# Altium schematic sheet main.SchDoc
size Tabloid; SheetNumber: 1; SheetTotal: 1; Page: main
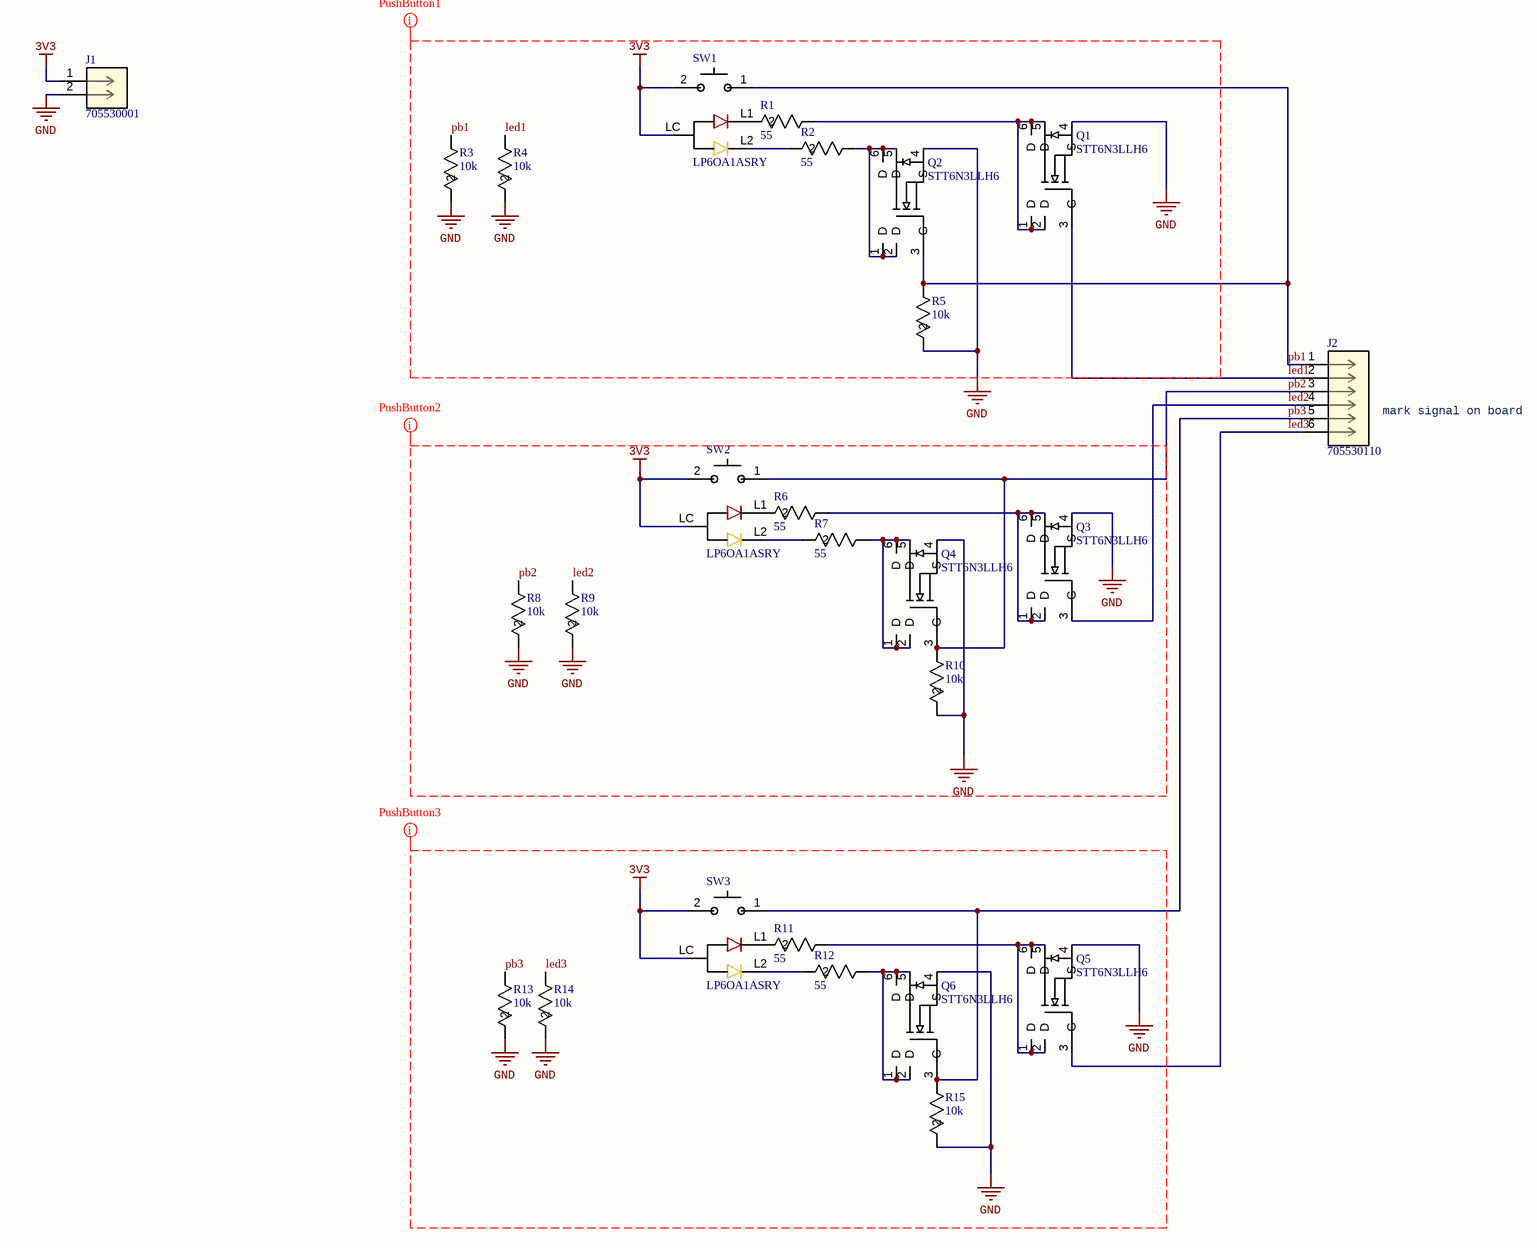
[diagram p0: main.SchDoc]

## Parts
J1  705530001  [CONN_705530001_02_MOL]
J2  705530110  [CONN_705530005_06_MOL]
Q1  STT6N3LLH6  [SOT_6N3LLH6_STM]
Q2  STT6N3LLH6  [SOT_6N3LLH6_STM]
Q3  STT6N3LLH6  [SOT_6N3LLH6_STM]
Q4  STT6N3LLH6  [SOT_6N3LLH6_STM]
Q5  STT6N3LLH6  [SOT_6N3LLH6_STM]
Q6  STT6N3LLH6  [SOT_6N3LLH6_STM]
R1  55  [RC0603N_YAG]
R2  55  [RC0603N_YAG]
R3  10k  [RC0603N_YAG]
R4  10k  [RC0603N_YAG]
R5  10k  [RC0603N_YAG]
R6  55  [RC0603N_YAG]
R7  55  [RC0603N_YAG]
R8  10k  [RC0603N_YAG]
R9  10k  [RC0603N_YAG]
R10  10k  [RC0603N_YAG]
R11  55  [RC0603N_YAG]
R12  55  [RC0603N_YAG]
R13  10k  [RC0603N_YAG]
R14  10k  [RC0603N_YAG]
R15  10k  [RC0603N_YAG]
SW1  LP6OA1ASRY  [LP6]
SW2  LP6OA1ASRY  [LP6]
SW3  LP6OA1ASRY  [LP6]

## Nets
3V3: J1.1 SW1.2 SW1.LC(red) SW2.2 SW2.LC(red) SW3.2 SW3.LC(red)
GND: J1.2 Q1.4(S) Q2.4(S) Q3.4(S) Q4.4(S) Q5.4(S) Q6.4(S) R3.2 R4.2 R5.2 R8.2 R9.2 R10.2 R13.2 R14.2 R15.2
led1: J2.2 Q1.3(G) R4.1
led2: J2.4 Q3.3(G) R9.1
led3: J2.6 Q5.3(G) R14.1
pb1: J2.1 Q2.3(G) R3.1 R5.1 SW1.1
pb2: J2.3 Q4.3(G) R8.1 R10.1 SW2.1
pb3: J2.5 Q6.3(G) R13.1 R15.1 SW3.1
NetQ1_1: Q1.1(D) Q1.2(D) Q1.5(D) Q1.6(D) R1.1
NetQ2_1: Q2.1(D) Q2.2(D) Q2.5(D) Q2.6(D) R2.1
NetQ3_1: Q3.1(D) Q3.2(D) Q3.5(D) Q3.6(D) R6.1
NetQ4_1: Q4.1(D) Q4.2(D) Q4.5(D) Q4.6(D) R7.1
NetQ5_1: Q5.1(D) Q5.2(D) Q5.5(D) Q5.6(D) R11.1
NetQ6_1: Q6.1(D) Q6.2(D) Q6.5(D) Q6.6(D) R12.1
NetR1_2: R1.2 SW1.L1(red)
NetR2_2: R2.2 SW1.L2(yellow)
NetR6_2: R6.2 SW2.L1(red)
NetR7_2: R7.2 SW2.L2(yellow)
NetR11_2: R11.2 SW3.L1(red)
NetR12_2: R12.2 SW3.L2(yellow)

## Layout directives
CompClassName: PushButton1: 3V3, GND, led1, pb1
CompClassName: PushButton2: 3V3, GND, led2, pb2
CompClassName: PushButton3: 3V3, GND, led3, pb3

## Notes on the sheet
- mark signal on board
- Board
- Page
- Author
- Date:
- File:

## Library data of the parts
J1 = 705530001: 2.54mm Pitch SL Header, Low Profile, Single Row, Right Angle, 3.05mm Pocket, Shrouded, 2 Circuits, 0.38Âµm Gold (Au) Selective Plating, Tin (Sn) PC Tail Plating; Manufacturer_Name: Molex Connector Corporation; Copyright: Copyright (C) 2025 Ultra Librarian. All rights reserved.; Manufacturer_Part_Number: 705530001; RefDes: RefDes; Type: Type
J2 = 705530110: 2.54mm Pitch SL Header, Low Profile, Single Row, Right Angle, 3.05mm Pocket, Shrouded, 6 Circuits, 0.38Âµm Gold (Au) Selective Plating, Tin (Sn) PC Tail Plating; Manufacturer_Name: Molex Connector Corporation; Copyright: Copyright (C) 2025 Ultra Librarian. All rights reserved.; Manufacturer_Part_Number: 705530110; RefDes: RefDes; Type: Type
Q1-Q6 = STT6N3LLH6: N-channel 30 V, 0.021 Ohm, 6 A STripFET(TM) VI DeepGATE(TM) Power MOSFET in SOT23-6L package; Manufacturer_Name: STMicroelectronics; Copyright: Copyright (C) 2026 Ultra Librarian. All rights reserved.; Manufacturer_Part_Number: STT6N3LLH6; RefDes: RefDes; Type: Type
R1 R2 R6 R7 R11 R12 = 0603 55Ohm: 55 OHM 0.1% 1/10W 0603; Manufacturer_Name: Yageo; Copyright: Copyright (C) 2026 Ultra Librarian. All rights reserved.; Manufacturer_Part_Number: 0603 55Ohm
R3-R5 R8-R10 R13-R15 = RT0603BRD0710KL: 10K OHM 0.1% 1/10W 0603; Manufacturer_Name: Yageo; Copyright: Copyright (C) 2026 Ultra Librarian. All rights reserved.; Manufacturer_Part_Number: RT0603BRD0710KL
SW1-SW3 = LP6OA1ASRY: LP6 Series Illuminated Pushbutton Switch Momentary SPST Red/Yellow; Manufacturer_Part_Number: LP6OA1ASRY